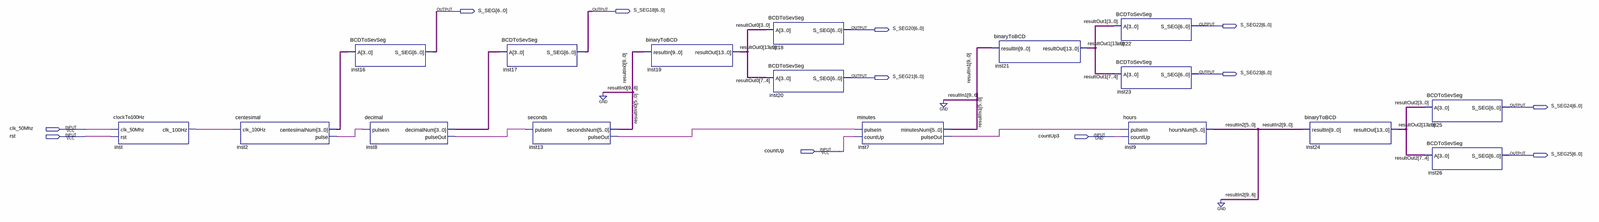
[diagram p0: schematic sheet, whole]
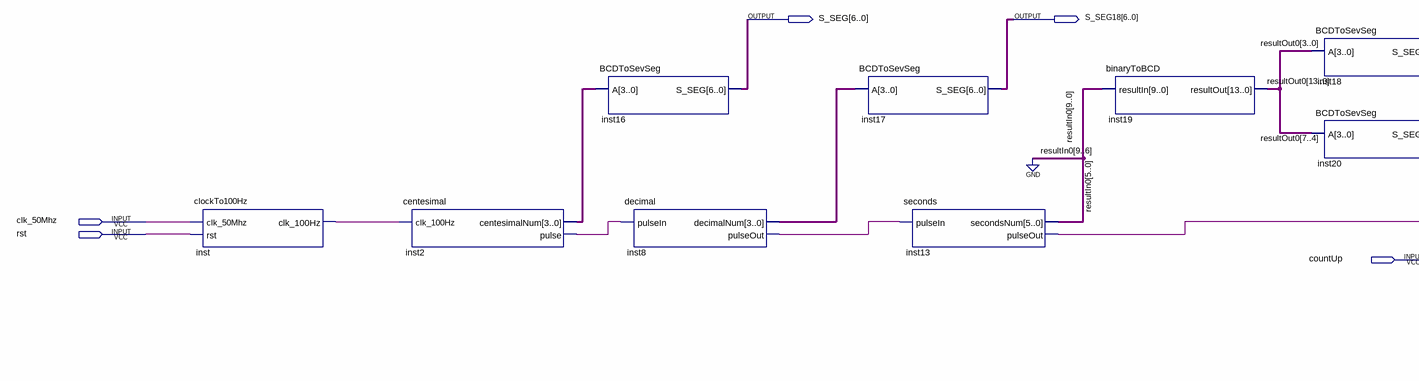
[diagram p1: schematic sheet, left part]
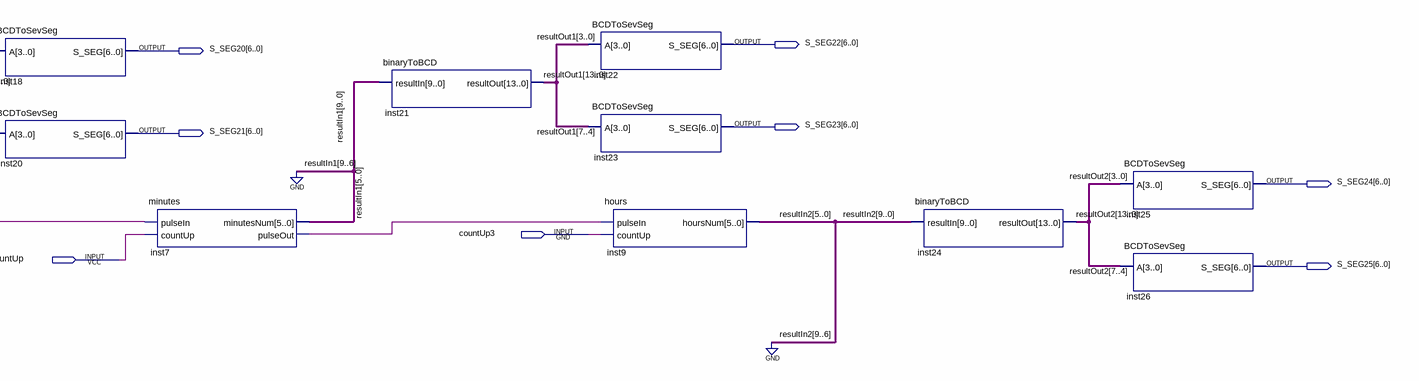
[diagram p2: schematic sheet, right part]
// Quartus schematic Sistema.bdf as structural Verilog: 17 symbols, 12 pins
module Sistema (
  input  clk_50Mhz,
  input  rst,
  input  countUp3,
  input  countUp,
  output [6:0] S_SEG,
  output [6:0] S_SEG18,
  output [6:0] S_SEG22,
  output [6:0] S_SEG20,
  output [6:0] S_SEG23,
  output [6:0] S_SEG21,
  output [6:0] S_SEG24,
  output [6:0] S_SEG25
);

  wire inst2_pulse, inst7_pulseout, inst8_pulseout, inst13_pulseout, inst_clk_100hz;
  wire [3:0] inst2_centesimalnum, inst8_decimalnum;
  wire [5:0] resultIn0, resultIn1, resultIn2;
  wire [13:0] resultOut0, resultOut1, resultOut2;

  clockTo100Hz inst (.clk_50Mhz(clk_50Mhz), .rst(rst), .clk_100Hz(inst_clk_100hz));
  centesimal inst2 (.clk_100Hz(inst_clk_100hz), .centesimalNum(inst2_centesimalnum), .pulse(inst2_pulse));
  BCDToSevSeg inst16 (.A(inst2_centesimalnum), .S_SEG(S_SEG));
  decimal inst8 (.pulseIn(inst2_pulse), .decimalNum(inst8_decimalnum), .pulseOut(inst8_pulseout));
  BCDToSevSeg inst17 (.A(inst8_decimalnum), .S_SEG(S_SEG18));
  seconds inst13 (.pulseIn(inst8_pulseout), .secondsNum(resultIn0), .pulseOut(inst13_pulseout));
  binaryToBCD inst19 (.resultIn({4'b0000, resultIn0}), .resultOut(resultOut0));
  BCDToSevSeg inst18 (.A(resultOut0[3:0]), .S_SEG(S_SEG20));
  BCDToSevSeg inst20 (.A(resultOut0[7:4]), .S_SEG(S_SEG21));
  minutes inst7 (.pulseIn(inst13_pulseout), .countUp(countUp), .minutesNum(resultIn1), .pulseOut(inst7_pulseout));
  binaryToBCD inst21 (.resultIn({4'b0000, resultIn1}), .resultOut(resultOut1));
  BCDToSevSeg inst22 (.A(resultOut1[3:0]), .S_SEG(S_SEG22));
  BCDToSevSeg inst23 (.A(resultOut1[7:4]), .S_SEG(S_SEG23));
  hours inst9 (.pulseIn(inst7_pulseout), .countUp(countUp3), .hoursNum(resultIn2));
  binaryToBCD inst24 (.resultIn({4'b0000, resultIn2}), .resultOut(resultOut2));
  BCDToSevSeg inst25 (.A(resultOut2[3:0]), .S_SEG(S_SEG24));
  BCDToSevSeg inst26 (.A(resultOut2[7:4]), .S_SEG(S_SEG25));
endmodule
